# Altium schematic sheet Connectors.SchDoc
size 420 x 297 mm; SheetNumber: 13; SheetTotal: 13
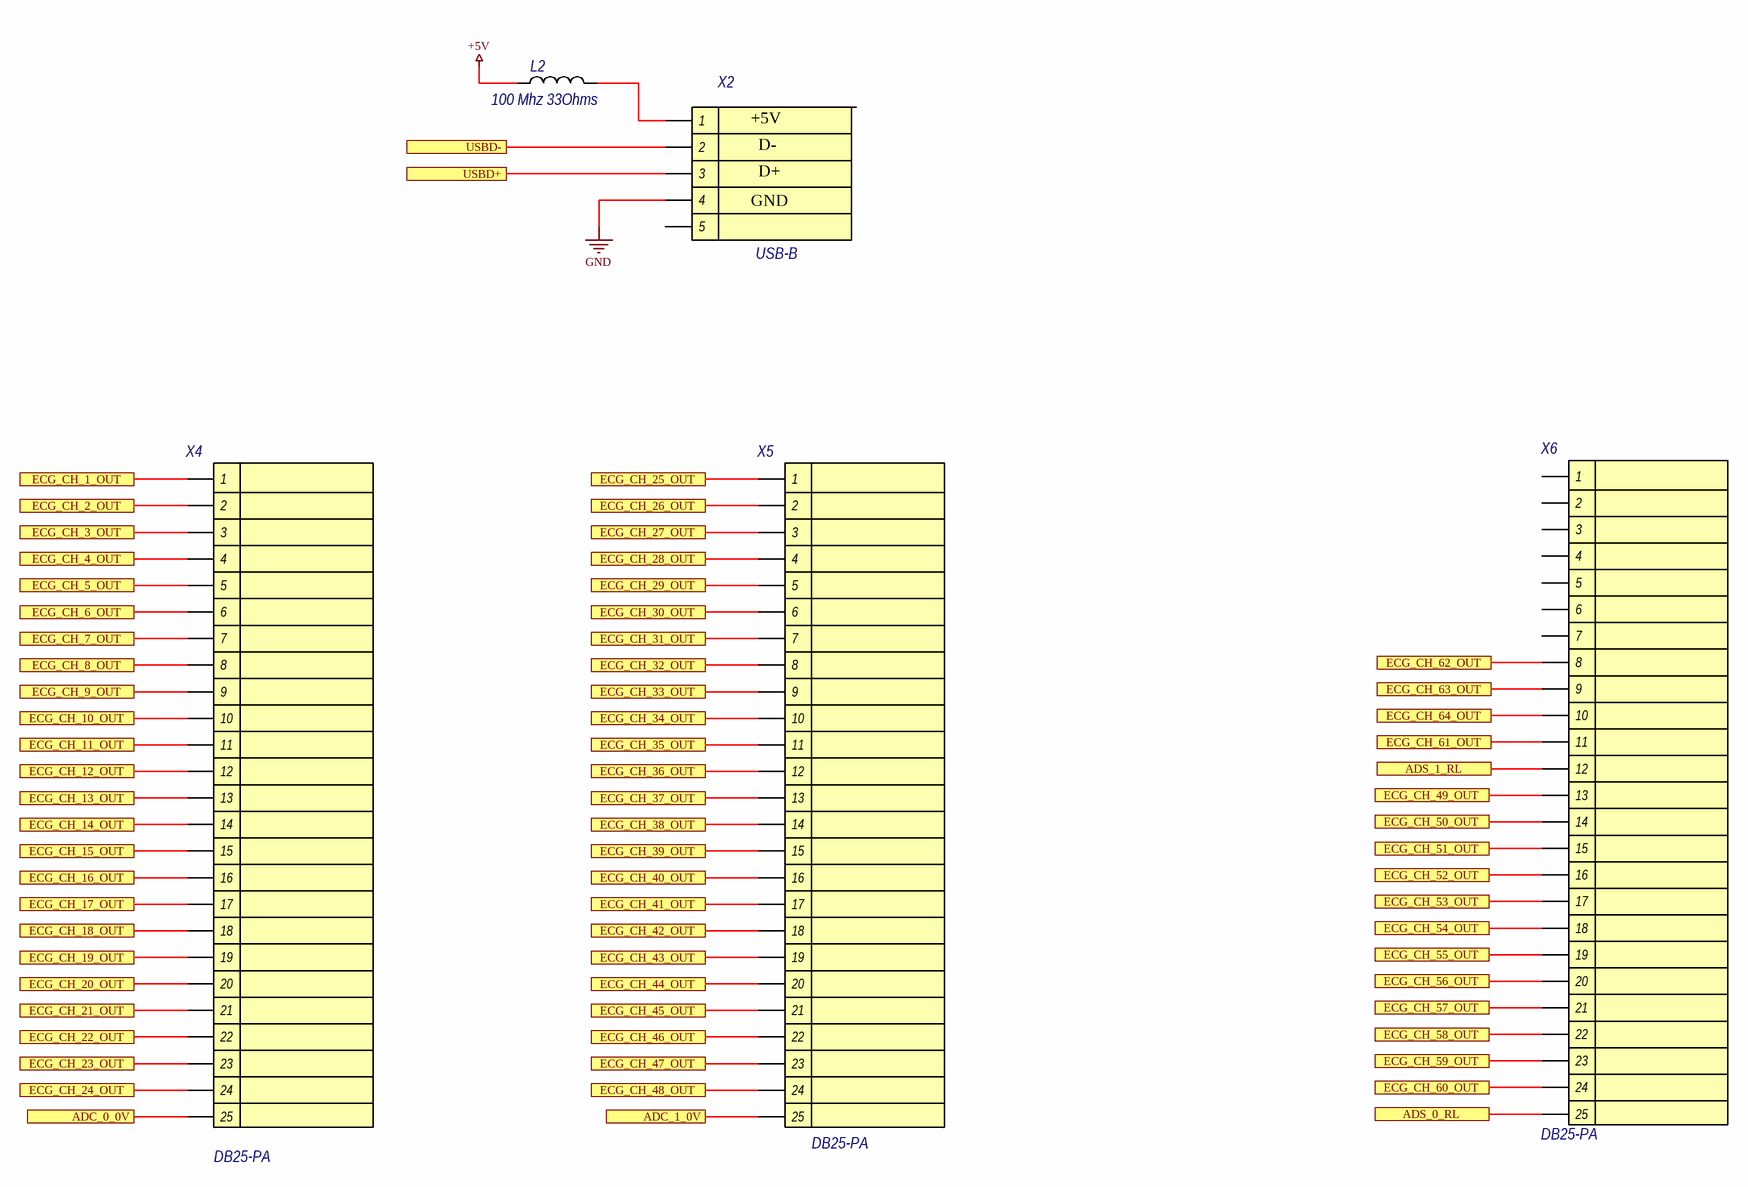
[diagram p0: Connectors.SchDoc]

## Parts
L2  100 Mhz 33Ohms  [1206]
X2  USB-B  [USB-B]
X4  DB25-PA  [DB25_FEMALE]
X5  DB25-PA  [DB25_FEMALE]
X6  DB25-PA  [DB25_FEMALE]

## Ports
ADC_0_0V, ADC_1_0V, ADS_0_RL, ADS_1_RL, ECG_CH_1_OUT, ECG_CH_2_OUT, ECG_CH_3_OUT, ECG_CH_4_OUT, ECG_CH_5_OUT, ECG_CH_6_OUT, ECG_CH_7_OUT, ECG_CH_8_OUT, ECG_CH_9_OUT, ECG_CH_10_OUT, ECG_CH_11_OUT, ECG_CH_12_OUT, ECG_CH_13_OUT, ECG_CH_14_OUT, ECG_CH_15_OUT, ECG_CH_16_OUT, ECG_CH_17_OUT, ECG_CH_18_OUT, ECG_CH_19_OUT, ECG_CH_20_OUT, ECG_CH_21_OUT, ECG_CH_22_OUT, ECG_CH_23_OUT, ECG_CH_24_OUT, ECG_CH_25_OUT, ECG_CH_26_OUT, ECG_CH_27_OUT, ECG_CH_28_OUT, ECG_CH_29_OUT, ECG_CH_30_OUT, ECG_CH_31_OUT, ECG_CH_32_OUT, ECG_CH_33_OUT, ECG_CH_34_OUT, ECG_CH_35_OUT, ECG_CH_36_OUT, ECG_CH_37_OUT, ECG_CH_38_OUT, ECG_CH_39_OUT, ECG_CH_40_OUT, ECG_CH_41_OUT, ECG_CH_42_OUT, ECG_CH_43_OUT, ECG_CH_44_OUT, ECG_CH_45_OUT, ECG_CH_46_OUT, ECG_CH_47_OUT, ECG_CH_48_OUT, ECG_CH_49_OUT, ECG_CH_50_OUT, ECG_CH_51_OUT, ECG_CH_52_OUT, ECG_CH_53_OUT, ECG_CH_54_OUT, ECG_CH_55_OUT, ECG_CH_56_OUT, ECG_CH_57_OUT, ECG_CH_58_OUT, ECG_CH_59_OUT, ECG_CH_60_OUT, ECG_CH_61_OUT, ECG_CH_62_OUT, ECG_CH_63_OUT, ECG_CH_64_OUT, USBD+, USBD-

## Nets
+5V: L2.1
GND: X2.4
ADC_0_0V: X4.25 ; port ADC_0_0V
ADC_1_0V: X5.25 ; port ADC_1_0V
ADS_0_RL: X6.25 ; port ADS_0_RL
ADS_1_RL: X6.12 ; port ADS_1_RL
ECG_CH_1_OUT: X4.1 ; port ECG_CH_1_OUT
ECG_CH_2_OUT: X4.2 ; port ECG_CH_2_OUT
ECG_CH_3_OUT: X4.3 ; port ECG_CH_3_OUT
ECG_CH_4_OUT: X4.4 ; port ECG_CH_4_OUT
ECG_CH_5_OUT: X4.5 ; port ECG_CH_5_OUT
ECG_CH_6_OUT: X4.6 ; port ECG_CH_6_OUT
ECG_CH_7_OUT: X4.7 ; port ECG_CH_7_OUT
ECG_CH_8_OUT: X4.8 ; port ECG_CH_8_OUT
ECG_CH_9_OUT: X4.9 ; port ECG_CH_9_OUT
ECG_CH_10_OUT: X4.10 ; port ECG_CH_10_OUT
ECG_CH_11_OUT: X4.11 ; port ECG_CH_11_OUT
ECG_CH_12_OUT: X4.12 ; port ECG_CH_12_OUT
ECG_CH_13_OUT: X4.13 ; port ECG_CH_13_OUT
ECG_CH_14_OUT: X4.14 ; port ECG_CH_14_OUT
ECG_CH_15_OUT: X4.15 ; port ECG_CH_15_OUT
ECG_CH_16_OUT: X4.16 ; port ECG_CH_16_OUT
ECG_CH_17_OUT: X4.17 ; port ECG_CH_17_OUT
ECG_CH_18_OUT: X4.18 ; port ECG_CH_18_OUT
ECG_CH_19_OUT: X4.19 ; port ECG_CH_19_OUT
ECG_CH_20_OUT: X4.20 ; port ECG_CH_20_OUT
ECG_CH_21_OUT: X4.21 ; port ECG_CH_21_OUT
ECG_CH_22_OUT: X4.22 ; port ECG_CH_22_OUT
ECG_CH_23_OUT: X4.23 ; port ECG_CH_23_OUT
ECG_CH_24_OUT: X4.24 ; port ECG_CH_24_OUT
ECG_CH_25_OUT: X5.1 ; port ECG_CH_25_OUT
ECG_CH_26_OUT: X5.2 ; port ECG_CH_26_OUT
ECG_CH_27_OUT: X5.3 ; port ECG_CH_27_OUT
ECG_CH_28_OUT: X5.4 ; port ECG_CH_28_OUT
ECG_CH_29_OUT: X5.5 ; port ECG_CH_29_OUT
ECG_CH_30_OUT: X5.6 ; port ECG_CH_30_OUT
ECG_CH_31_OUT: X5.7 ; port ECG_CH_31_OUT
ECG_CH_32_OUT: X5.8 ; port ECG_CH_32_OUT
ECG_CH_33_OUT: X5.9 ; port ECG_CH_33_OUT
ECG_CH_34_OUT: X5.10 ; port ECG_CH_34_OUT
ECG_CH_35_OUT: X5.11 ; port ECG_CH_35_OUT
ECG_CH_36_OUT: X5.12 ; port ECG_CH_36_OUT
ECG_CH_37_OUT: X5.13 ; port ECG_CH_37_OUT
ECG_CH_38_OUT: X5.14 ; port ECG_CH_38_OUT
ECG_CH_39_OUT: X5.15 ; port ECG_CH_39_OUT
ECG_CH_40_OUT: X5.16 ; port ECG_CH_40_OUT
ECG_CH_41_OUT: X5.17 ; port ECG_CH_41_OUT
ECG_CH_42_OUT: X5.18 ; port ECG_CH_42_OUT
ECG_CH_43_OUT: X5.19 ; port ECG_CH_43_OUT
ECG_CH_44_OUT: X5.20 ; port ECG_CH_44_OUT
ECG_CH_45_OUT: X5.21 ; port ECG_CH_45_OUT
ECG_CH_46_OUT: X5.22 ; port ECG_CH_46_OUT
ECG_CH_47_OUT: X5.23 ; port ECG_CH_47_OUT
ECG_CH_48_OUT: X5.24 ; port ECG_CH_48_OUT
ECG_CH_49_OUT: X6.13 ; port ECG_CH_49_OUT
ECG_CH_50_OUT: X6.14 ; port ECG_CH_50_OUT
ECG_CH_51_OUT: X6.15 ; port ECG_CH_51_OUT
ECG_CH_52_OUT: X6.16 ; port ECG_CH_52_OUT
ECG_CH_53_OUT: X6.17 ; port ECG_CH_53_OUT
ECG_CH_54_OUT: X6.18 ; port ECG_CH_54_OUT
ECG_CH_55_OUT: X6.19 ; port ECG_CH_55_OUT
ECG_CH_56_OUT: X6.20 ; port ECG_CH_56_OUT
ECG_CH_57_OUT: X6.21 ; port ECG_CH_57_OUT
ECG_CH_58_OUT: X6.22 ; port ECG_CH_58_OUT
ECG_CH_59_OUT: X6.23 ; port ECG_CH_59_OUT
ECG_CH_60_OUT: X6.24 ; port ECG_CH_60_OUT
ECG_CH_61_OUT: X6.11 ; port ECG_CH_61_OUT
ECG_CH_62_OUT: X6.8 ; port ECG_CH_62_OUT
ECG_CH_63_OUT: X6.9 ; port ECG_CH_63_OUT
ECG_CH_64_OUT: X6.10 ; port ECG_CH_64_OUT
USBD+: X2.3 ; port USBD+
USBD-: X2.2 ; port USBD-
NetL2_2: L2.2 X2.1

Not connected (* = marked no-connect by the designer): X2 5; X6 1 2 3 4 5 6 7

## Notes on the sheet
- +5V
- D-
- GND
- D+
- Перв. примен.
- Справ. №
- Подп. и дата
- Инв. № дубл.
- Взам. инв. №
- Разраб.
- Изм.
- Лист
- № докум.
- Подп.
- Дата
- Лит.
- Масса
- Масштаб
- Пров.
- Т.контр.
- Листов
- Инв. № подл.
- Утв.
- Н.контр.
- 2.106-A3
- Копировал
- Формат А3

## Library data of the parts
L2 = IND_BLM31PG330SN1L: Ferrite Bead; Manufacturer 1: Coilcraft; Tolerance: ±10%; SCDType: spec; Package: 1206; PartNumber: BLM31PG330SN1L; Manufacturer Part Number 1: 100 Mhz 33Ohms
X2 = CONN_USB-B: STD USB TYPE B; Manufacturer: TE Connectivity; Part Number: 292317-4; Desc: Разъем на плату
X4-X6 = CONN_DB25_FEMALE: Value: DB25-PA; PartNumber: DB25-PA